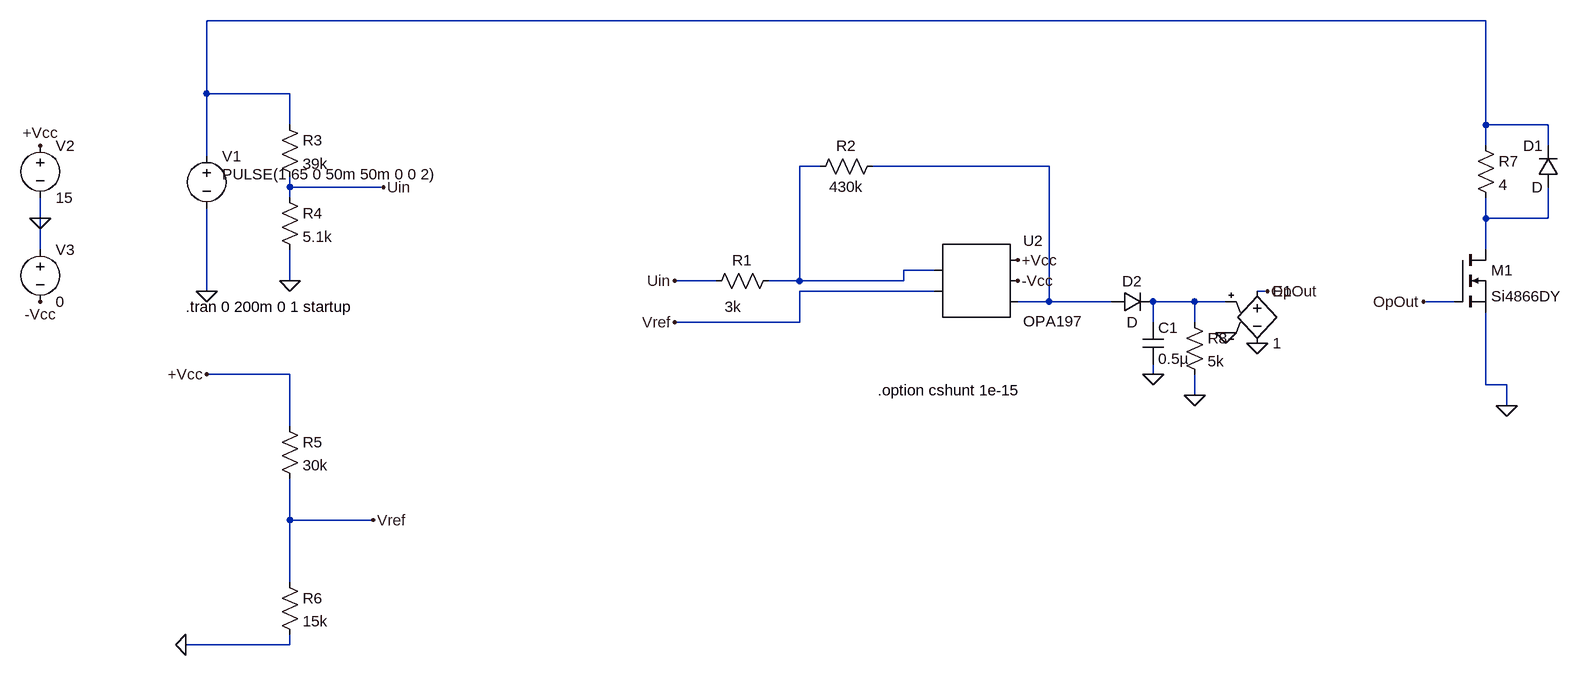
[diagram p0: schematic Dc Chopper with inverting signal.asc]
Dc Chopper with inverting signal.asc, the LTspice schematic file:
Version 4
SHEET 1 1304 836
WIRE 1184 -288 -784 -288
WIRE -784 -176 -784 -288
WIRE -656 -176 -784 -176
WIRE -656 -128 -656 -176
WIRE 1184 -128 1184 -288
WIRE 1280 -128 1184 -128
WIRE 1184 -96 1184 -128
WIRE 1280 -96 1280 -128
WIRE -784 -80 -784 -176
WIRE 160 -64 128 -64
WIRE 512 -64 240 -64
WIRE -656 -32 -656 -48
WIRE -512 -32 -656 -32
WIRE -656 -16 -656 -32
WIRE -1040 16 -1040 -16
WIRE 1184 16 1184 -16
WIRE 1280 16 1280 -32
WIRE 1280 16 1184 16
WIRE -1040 64 -1040 16
WIRE 1184 64 1184 16
WIRE 336 96 288 96
WIRE -656 112 -656 64
WIRE 0 112 -64 112
WIRE 128 112 128 -64
WIRE 128 112 80 112
WIRE 288 112 288 96
WIRE 288 112 128 112
WIRE -784 128 -784 0
WIRE 336 128 128 128
WIRE 848 128 832 128
WIRE 512 144 512 -64
WIRE 512 144 464 144
WIRE 608 144 512 144
WIRE 736 144 672 144
WIRE 784 144 736 144
WIRE 1136 144 1088 144
WIRE 128 176 128 128
WIRE 128 176 -64 176
WIRE 672 176 672 144
WIRE 736 176 736 144
WIRE -656 256 -784 256
WIRE 672 256 672 240
WIRE 1184 272 1184 160
WIRE 1216 272 1184 272
WIRE 736 288 736 256
WIRE 1216 304 1216 272
WIRE -656 336 -656 256
WIRE -656 480 -656 416
WIRE -528 480 -656 480
WIRE -656 576 -656 480
WIRE -656 672 -656 656
WIRE -656 672 -816 672
FLAG 464 80 +Vcc
FLAG 464 112 -Vcc
FLAG -64 112 Uin
FLAG -784 256 +Vcc
FLAG 848 128 OpOut
FLAG -784 128 0
FLAG -512 -32 Uin
FLAG -1040 16 0
FLAG -1040 -96 +Vcc
FLAG -1040 144 -Vcc
FLAG -656 112 0
FLAG -816 672 0
FLAG -528 480 Vref
FLAG -64 176 Vref
FLAG 1088 144 OpOut
FLAG 1216 304 0
FLAG 832 208 0
FLAG 784 192 0
FLAG 672 256 0
FLAG 736 288 0
SYMBOL res 96 96 R90
WINDOW 0 0 56 VBottom 2
WINDOW 3 40 70 VTop 2
SYMATTR InstName R1
SYMATTR Value 3k
SYMBOL res 256 -80 R90
WINDOW 0 0 56 VBottom 2
WINDOW 3 32 56 VTop 2
SYMATTR InstName R2
SYMATTR Value 430k
SYMBOL res -672 -144 R0
SYMATTR InstName R3
SYMATTR Value 39k
SYMBOL res -672 -32 R0
SYMATTR InstName R4
SYMATTR Value 5.1k
SYMBOL voltage -784 -96 R0
WINDOW 123 0 0 Left 2
WINDOW 39 0 0 Left 2
WINDOW 3 24 44 Left 2
SYMATTR Value PULSE(1 65 0 50m 50m 0 0 2)
SYMATTR InstName V1
SYMBOL voltage -1040 -112 R0
WINDOW 123 0 0 Left 2
WINDOW 39 0 0 Left 2
SYMATTR InstName V2
SYMATTR Value 15
SYMBOL voltage -1040 48 R0
WINDOW 123 0 0 Left 2
WINDOW 39 0 0 Left 2
SYMATTR InstName V3
SYMATTR Value 0
SYMBOL res -672 320 R0
SYMATTR InstName R5
SYMATTR Value 30k
SYMBOL res -672 560 R0
SYMATTR InstName R6
SYMATTR Value 15k
SYMBOL nmos 1136 64 R0
SYMATTR InstName M1
SYMATTR Value Si4866DY
SYMBOL res 1168 -112 R0
SYMATTR InstName R7
SYMATTR Value 4
SYMATTR SpiceLine pwr=500
SYMBOL diode 1296 -32 R180
WINDOW 0 24 64 Left 2
WINDOW 3 24 0 Left 2
SYMATTR InstName D1
SYMBOL AutoGenerated\\OPA197 400 112 R0
SYMATTR InstName U2
SYMBOL e 832 112 R0
SYMATTR InstName E1
SYMATTR Value 1
SYMBOL diode 608 160 R270
WINDOW 0 32 32 VTop 2
WINDOW 3 0 32 VBottom 2
SYMATTR InstName D2
SYMBOL cap 656 176 R0
SYMATTR InstName C1
SYMATTR Value 0.5µ
SYMBOL res 720 160 R0
SYMATTR InstName R8
SYMATTR Value 5k
TEXT -816 152 Left 2 !.tran 0 200m 0 1 startup
TEXT 248 280 Left 2 !.option cshunt 1e-15

The netlist it stands for:
* Dc Chopper with inverting signal.asc
R1 N002 Uin 3k
R2 N003 N002 430k
R3 N001 Uin 39k
R4 Uin 0 5.1k
V1 N001 0 PULSE(1 65 0 50m 50m 0 0 2)
V2 +Vcc 0 15
V3 0 -Vcc 0
R5 +Vcc Vref 30k
R6 Vref 0 15k
M1 N004 OpOut 0 0 Si4866DY
R7 N001 N004 4 pwr=500
D1 N004 N001 D
* U2: OPA197 (symbol AutoGenerated\OPA197 not available, pins judged from their places): pin1=N002 pin2=Vref pin3=+Vcc pin4=-Vcc pin5=N003
E1 OpOut 0 N005 0 1
D2 N003 N005 D
C1 N005 0 0.5µ
R8 N005 0 5k
.model D D
.lib standard.dio
.model NMOS NMOS
.model PMOS PMOS
.lib standard.mos
.tran 0 200m 0 1 startup
.option cshunt 1e-15
.backanno
.end